# EAGLE schematic TXS0108E (EAGLE 9.1.0)
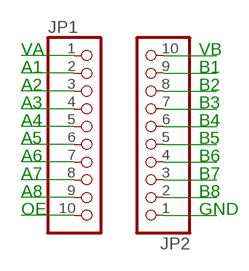
[diagram p0: schematic, sheet 1]

## Parts
JP1  PINHD-1X10  [1X10]
JP2  PINHD-1X10  [1X10]

## Nets
N$1: JP2.10
N$2: JP2.9
N$3: JP2.8
N$4: JP2.7
N$5: JP2.6
N$6: JP2.5
N$7: JP2.4
N$8: JP2.3
N$9: JP2.2
N$10: JP2.1
N$11: JP1.1
N$12: JP1.2
N$13: JP1.3
N$14: JP1.4
N$15: JP1.5
N$16: JP1.6
N$17: JP1.7
N$18: JP1.8
N$19: JP1.9
N$20: JP1.10

## Notes on the sheet
- VA | VB
- A1 | B1
- A2 | B2
- A3 | B3
- A4 | B4
- A5 | B5
- A6 | B6
- A7 | B7
- A8 | B8
- OE | GND

## Library data of the parts
JP1 = pinhead:PINHD-1X10: PIN HEADER; SPICEPREFIX: X
JP2 = pinhead:PINHD-1X10: PIN HEADER